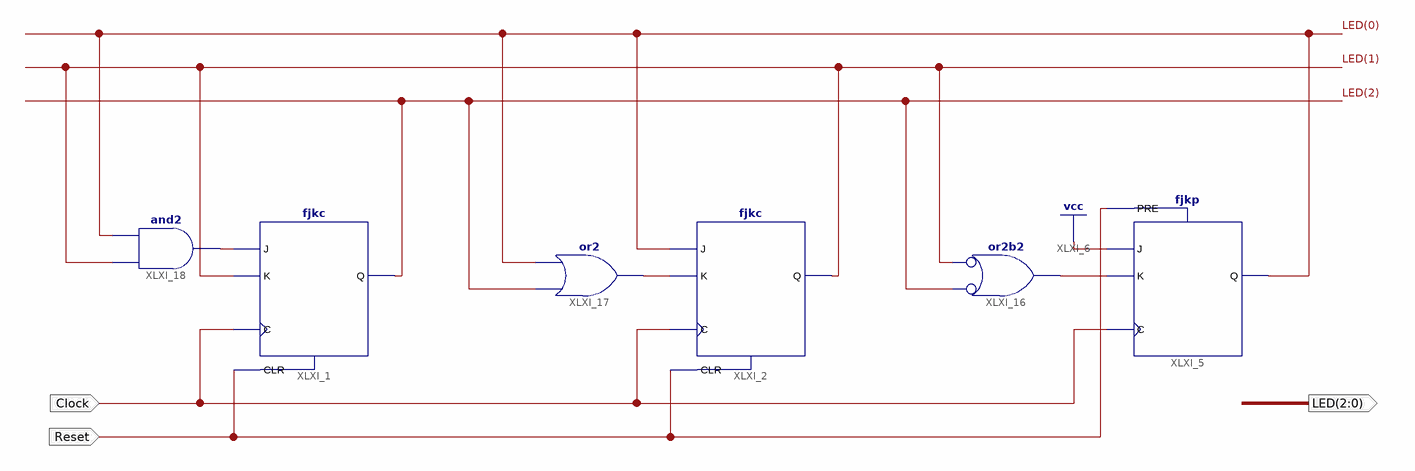
[diagram p0: schematic sheet 1]
// Xilinx ISE schematic Counter1to6.sch (spartan6) as structural Verilog: 6 symbols, 3 ports
module Counter1to6 (
  input  Clock,
  input  Reset,
  output [2:0] LED
);

  wire XLXN_20, XLXN_28, XLXN_32;

  fjkc XLXI_1 (.C(Clock), .CLR(Reset), .J(XLXN_32), .K(LED[1]), .Q(LED[2]));
  fjkc XLXI_2 (.C(Clock), .CLR(Reset), .J(LED[0]), .K(XLXN_28), .Q(LED[1]));
  fjkp XLXI_5 (.C(Clock), .J(1'b1), .K(XLXN_20), .PRE(Reset), .Q(LED[0]));
  or XLXI_16 (XLXN_20, ~LED[2], ~LED[1]);  // or2b2
  or XLXI_17 (XLXN_28, LED[2], LED[0]);
  and XLXI_18 (XLXN_32, LED[1], LED[0]);

  // Notes on the sheet:
  //   LOC on signal Clock = P45
  //   CLOCK_DEDICATED_ROUTE on signal Clock = TRUE
  //   LOC on signal Reset = P46
  //   LOC on signal LED(2:0) = P80,P81,P82
endmodule
